# EAGLE design Webasto X250_3 (EAGLE 8.2.2)
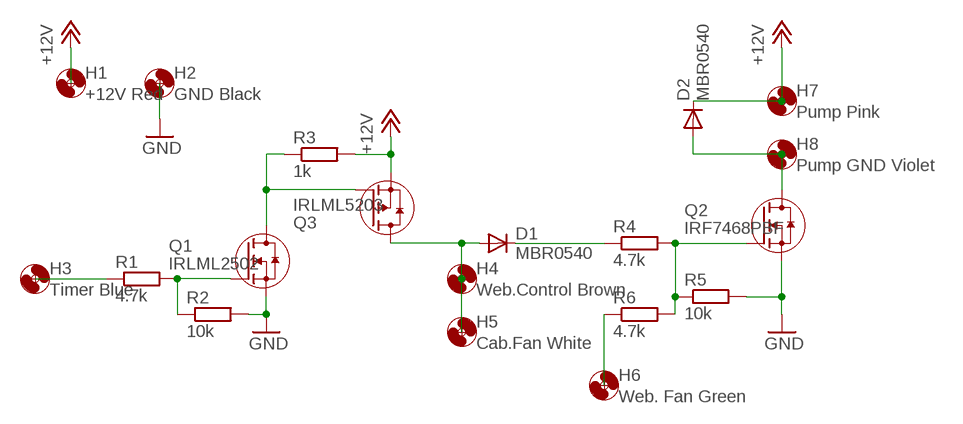
[diagram p0: schematic, sheet 1]

## Parts
D1  MBR0540  CGRM4001-G  [SOD-123_MINI-SMA]
D2  MBR0540  CGRM4001-G  [SOD-123_MINI-SMA]
H1  +12V Red  MOUNT-HOLE3.6  [3,6]
H2  GND Black  MOUNT-HOLE3.6  [3,6]
H3  Timer Blue  MOUNT-HOLE3.6  [3,6]
H4  Web.Control Brown  MOUNT-HOLE3.6  [3,6]
H5  Cab.Fan White  MOUNT-HOLE3.6  [3,6]
H6  Web. Fan Green  MOUNT-HOLE3.6  [3,6]
H7  Pump Pink  MOUNT-HOLE3.6  [3,6]
H8  Pump GND Violet  MOUNT-HOLE3.6  [3,6]
Q1  IRLML2502  SI2302  [SOT-23-GSD]
Q2  IRF7468PBF  [SO08]
Q3  IRLML5203  [SOT-23-GSD]
R1  4.7k  R-EU_R0603  [R0603]
R2  10k  R-EU_R0603  [R0603]
R3  1k  R-EU_R0603  [R0603]
R4  4.7k  R-EU_R0603  [R0603]
R5  10k  R-EU_R0603  [R0603]
R6  4.7k  R-EU_R0603  [R0603]

## Nets
+12V: D2.C H1.P$1 H7.P$1 Q3.S R3.2
GND: H2.P$1 Q1.S Q2.1(S) Q2.2(S) Q2.3(S) R2.2 R5.2
N$1: Q1.G R1.2 R2.1
N$2: H3.P$1 R1.1
N$3: Q1.D Q3.G R3.1
N$4: D1.A H4.P$1 H5.P$1 Q3.D
N$5: Q2.4(G) R4.2 R5.1 R6.2
N$6: D2.A H8.P$1 Q2.5(D) Q2.6(D) Q2.7(D) Q2.8(D)
N$7: H6.P$1 R6.1
N$8: D1.C R4.1

## Library data of the parts
D1 D2 = diode:CGRM400*-G: Molded plasitc,JEDEC SOD-123/Mini SMA Source: Comchip CGRM4001-G.pdf
H1-H8 = holes:MOUNT-HOLE: MOUNTING HOLE with drill center marker
Q1 = usb:SI2302: N-канальный полевик
Q2 = usb:IRF7468PBF
Q3 = usb:IRLML5203
R1-R6 = rcl:R-EU_: RESISTOR, European symbol

## Board
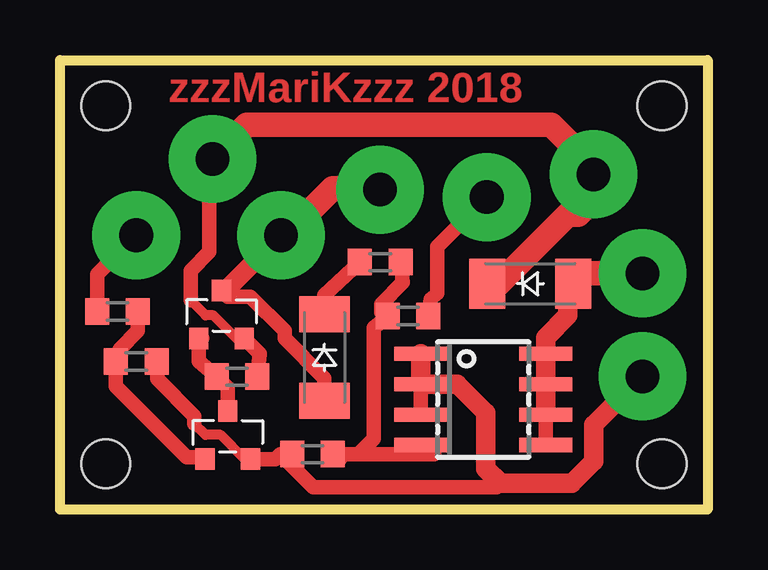
[diagram p1: board, top side]

Size 26.99 x 18.73 mm. Coordinates in mm from the lower left corner, seen from the top.
Outline: 0,18.73 26.99,18.73 26.99,0 0,0 0,18.73
Copper layers (1*16): Top 0.035mm / dielectric 1.5mm / Bottom 0.035mm
Design rules "My": minimum track width 16mil, minimum drill 0.35mm, track to track 12mil, track to pad 12mil, pad to pad 12mil, via to via 12mil, smd to smd 12mil, copper to edge 40mil, drill to drill 24mil, minimum pad ring 10mil, minimum via ring 8mil, stop-mask expansion 4mil, vias tented up to drill 0mil, thermal gap 10mil
Holes 2.03 mm at 1.91,16.83 25.08,16.83 1.91,1.91 25.08,1.91

### Footprints (pad centres in the part's own frame; a part is rotated, then mirrored left to right if it is on the bottom)
SOD-123_MINI-SMA = smd 1.5 x 2.1: A 1.8,0; C -1.8,0
3,6 = drill 1.4 pad 3.658: P$1 0,0
SOT-23-GSD = smd 0.8 x 0.9: D 0,2; G -0.95,0; S 0.95,0
SO08 = smd 0.6 x 2.2: 1 -1.905,-2.6; 2 -0.635,-2.6; 3 0.635,-2.6; 4 1.905,-2.6; 5 1.905,2.6; 6 0.635,2.6; 7 -0.635,2.6; 8 -1.905,2.6
R0603 = smd 1 x 1.1: 1 -0.85,0; 2 0.85,0

### Placement (x,y rotation side)
D1  11.02,6.34 270 top
D2  19.59,9.41 0 top
H1  6.35,14.61 0 top
H2  24.27,5.55 0 top
H3  3.17,11.43 0 top
H4  9.21,11.43 0 top
H5  13.34,13.33 0 top
H6  17.78,13.02 0 top
H7  22.23,13.97 0 top
H8  24.27,9.84 0 top
Q1  6.99,2.11 0 top
Q2  17.64,4.59 270 top
Q3  6.73,7.13 0 top
R1  2.4,8.26 0 top
R2  3.17,6.17 0 top
R3  7.38,5.54 0 top
R4  13.34,10.31 0 top
R5  10.52,2.31 180 top
R6  14.5,8.06 180 top

### Tracks (layer width: path | path; a pad name or v marks a point on that pad's centre or on a via)
+12V
  Top 0.406: 5.45,8.71 6.07,8.09 6.39,8.09 7.35,7.13 Q3.S
  Top 0.61: 5.45,8.71 5.45,9.96 6.22,10.73 6.22,14.48 H1.P$1 | R3.2 8.33,6.49 Q3.S | H7.P$1 22.23,13.53
  Top 1.016: H1.P$1 7.78,16.04 20.48,16.04 22.23,14.29 H7.P$1 22.23,12.91 21.6,12.29 21.16,12.29 18.28,9.41 D2.C
GND
  Top 0.406: Q1.S 7.7,2.1 6.69,3.11 6.07,3.11 5.6,3.58
  Top 0.61: 9.18,2.31 R5.2 | 9.18,2.31 10.55,0.93 18.2,0.93 18.36,1.09 | Q2.2 Q2.3 | 5.6,3.58 5.6,3.89 4.04,5.45 4.04,6.15 R2.2 | Q1.S 8.98,2.1 9.18,2.31
  Top 0.813: Q2.1 Q2.2 16.56,5.22 17.74,4.04 17.74,1.71 18.36,1.09 21.31,1.09 22.25,2.02 22.25,3.53 H2.P$1
N$1
  Top 0.61: R1.2 3.25,7.45 2.49,6.69 2.49,6.33 R2.1 2.33,5.14 5.29,2.18 5.97,2.18 Q1.G
N$2
  Top 0.61: R1.1 1.55,9.8 H3.P$1
N$3
  Top 0.61: 5.92,7.13 Q3.G 5.78,6.19 R3.1 6.99,5.08 Q1.D
N$4
  Top 0.61: D1.A 11.02,5.47 9.36,7.13 9.36,7.44 7.93,8.87 7,8.87 Q3.D
  Top 0.813: Q3.D 6.91,9.13 H4.P$1
  Top 1.016: H4.P$1 9.41,11.43 11.36,13.38 13.28,13.38 H5.P$1
N$5
  Top 0.61: 11.67,2.11 R5.1 12.45,2.31 | R4.2 14.29,9.47 13.38,8.56 13.38,8.23 R6.2 13.07,7.59 13.07,2.96 12.45,2.33 12.45,2.31 | 12.45,2.31 15.6,2.31 Q2.4
N$6
  Top 0.61: Q2.6 Q2.5
  Top 0.813: Q2.6 Q2.7 Q2.8 20.24,7.17 21.16,8.09 21.16,9.18 D2.A
  Top 1.016: H8.P$1 21.82,9.84 D2.A
N$7
  Top 0.61: 15.45,8.45 R6.1 15.45,8.76 15.71,9.02 15.71,10.95 H6.P$1
N$8
  Top 0.61: D1.C 11.02,8.94 R4.1
(copper drawn outside any net)
  shapes: Top circle x4

### Text on the board
Top: zzzMariKzzz 2018